# Altium schematic sheet Power Generation - Connector.SchDoc: [3] Power Generation - Connector
size A4; ApprovedBy: Nagy Richard; CheckedBy: Nagy Richard; Author: Nagy Richard; CompanyName: EmbedCore; DrawnBy: Nagy Richard; Engineer: Nagy Richard; Organization: EmbedCore; DocumentNumber: 3; Revision: 1.0; SheetNumber: 3; SheetTotal: 15
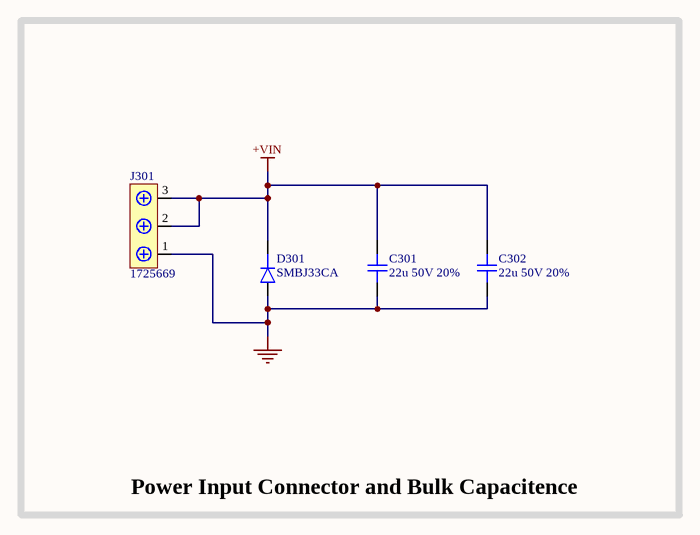
[diagram p0: Power Generation - Connector.SchDoc]

## Parts
C301  22u 50V 20%  [CAP-EL-NP-5MM]
C302  22u 50V 20%  [CAP-EL-NP-5MM]
D301  SMBJ33CA  [DO-214AC-2 (SMA)]
J301  1725669  [1725669]

## Blocks framed on the sheet
Power Input Connector and Bulk Capacitence: C301 C302 D301 J301

## Nets
+VIN: C301.1 C302.1 D301.K J301.2 J301.3
GND: C301.2 C302.2 D301.A J301.1

## Notes on the sheet
- Title:
- Drawn By:
- Page Contents:
- Checked By:
- Size:
- Date:
- File:
- License:
- Email:
- A4
- Number:
- Time:
- Revision:
- Sheet
- Website:
- of

## Library data of the parts
C301 C302 = CAP_EL_NP_5MM: Capacitor SMD Electrolytic Non-Polarised 5mm Diameter; Manufacturer: PANASONIC; Manufacturer Part Number: EEEFT1H220AR
D301 = D_SMA: Diode SMD SMA (DO-214AA); Manufacturer: Littelfuse; Manufacturer Part Number: SMBJ33CA
J301 = 1725669: Screw Terminal Block 3 Positions 2.54mm; Manufacturer: Phoenix; Manufacturer Part Number: 1725669; Distributor Link: https://www.mouser.de/ProductDetail/Phoenix-Contact/1725669?qs=A%2FKWGUWTCZjmkTL0Oe91ew%3D%3D